# Altium schematic sheet Power.SchDoc
size A4
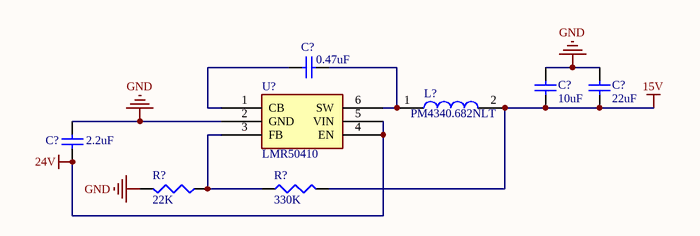
[diagram p0: Power.SchDoc]

## Parts
(Parts that share a designator on the sheet are numbered #1, #2 ... from top to bottom, then left to right.)
C?#1  value 0.47uF  [C0805]  (hidden comment: Cap)
C?#2  value 10uF  [C0805]  (hidden comment: Cap)
C?#3  value 22uF  [C0805]  (hidden comment: Cap)
C?#4  value 2.2uF  [C0805]  (hidden comment: Cap)
L?  PM4340.682NLT  [PM4340682NLT]
R?#1  value 330K  [J1-0603]  (hidden comment: Res3)
R?#2  value 22K  [J1-0603]  (hidden comment: Res3)
U?  LMR50410  [LMR50410]

## Nets
15V: C?#2.2 C?#3.2 L?.2 R?#1.2
24V: C?#4.2 U?.4(EN) U?.5(VIN)
GND: C?#2.1 C?#3.1 C?#4.1 R?#2.2 U?.2(GND)
NetC?#1_1: C?#1.1 U?.1(CB)
NetC?#1_2: C?#1.2 L?.1 U?.6(SW)
NetR?#1_1: R?#1.1 R?#2.1 U?.3(FB)

## Library data of the parts
C?#1-C?#4 = Cap: Capacitor; Published: 8-Jun-2000; LatestRevisionDate: 17-Jul-2002; LatestRevisionNote: Re-released for DXP Platform.; PackageReference: RAD-0.3; Publisher: Altium Limited; PackageDescription: Radial Cap, Thru-Hole; 2 Leads; 0.3 in Pin Spacing
L? = PM4340.682NLT: Inductor; Manufacturer_Name: Pulse; Datasheet Link: https://eu.mouser.com/ProductDetail/Pulse-Electronics/PM4345682NLT?qs=OTrKUuiFdkYTz4rt1sdWWw%3D%3D; Height: 2mm; Manufacturer_Part_Number: PM4340.682NLT
R?#1 R?#2 = Res3: Resistor; Published: 8-Jun-2000; LatestRevisionDate: 29-May-2009; LatestRevisionNote: IPC-7351 Footprint Added.; PackageReference: J1-0603; Publisher: Altium Limited; PackageDescription: Chip Resistor
U? = LMR50410: 4V to 36V 1A, Buck Converter; Manufacturer: Texas Instruments; Manufacturer Part Number: LMR50410YQDBVRQ1; Datasheet: https://www.ti.com/lit/ds/symlink/lmr50410-q1.pdf; Supplier Part Number: LMR50410YQDBVRQ1CT-ND; Supplier: Digikey